# Altium schematic sheet BlockDiagram.SchDoc
size A4; DrawnBy: Santiago Rodriguez; Revision: V1; SheetNumber: 2; SheetTotal: 10
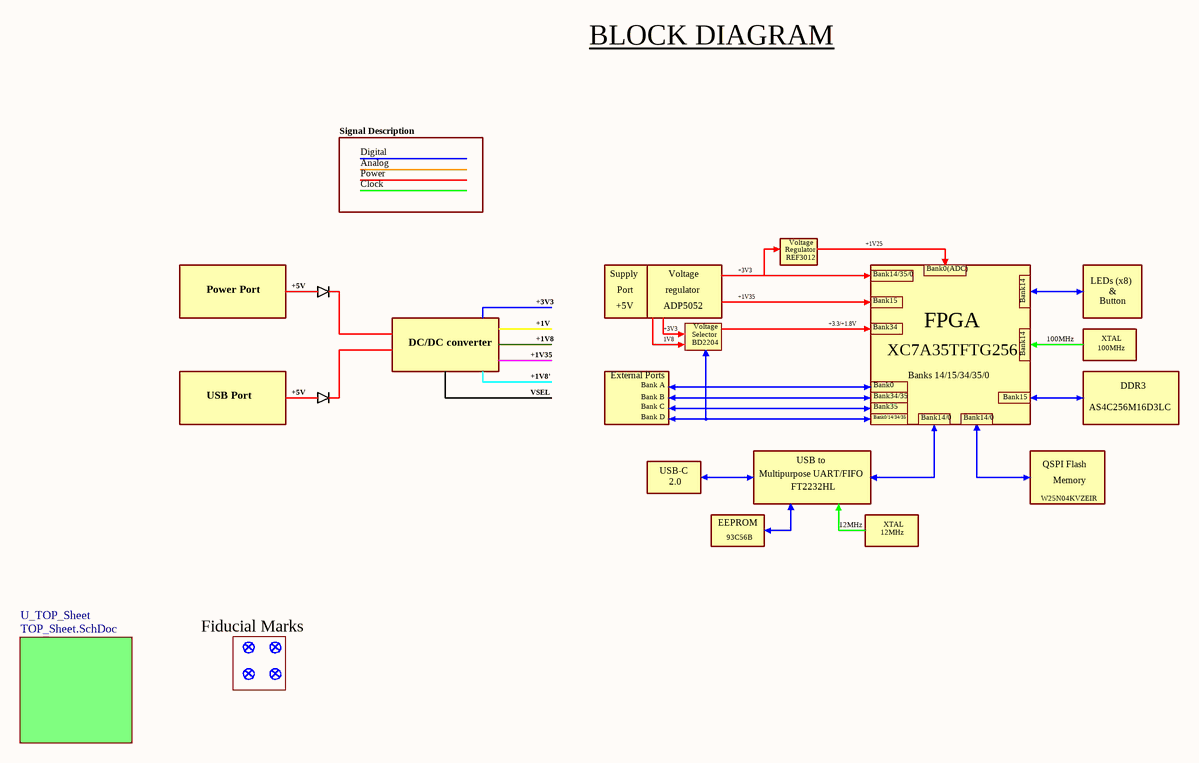
[diagram p0: BlockDiagram.SchDoc]

## Sub-sheets
U_TOP_Sheet = TOP_Sheet.SchDoc: no entries

## Notes on the sheet
- BLOCK DIAGRAM
- Signal Description
- Digital
- Analog
- Power
- Clock
- Power Port
- +5V
- +3V3
- Supply
- Port
- ADP5052
- regulator
- Voltage
- +1V35
- Regulator
- REF3012
- +1V25
- Bank14/35/0
- Bank15
- Bank0(ADC)
- Bank14
- LEDs (x8)
- Button
- &
- DC/DC converter
- +1V8'
- +1V
- +1V8
- External Ports
- 1V8
- Selector
- BD2204
- +3.3/+1.8V
- Bank34
- XC7A35TFTG256
- Banks 14/15/34/35/0
- FPGA
- 100MHz
- XTAL
- USB Port
- VSEL
- Bank A
- Bank B
- Bank C
- Bank D
- Bank0
- Bank34/35
- Bank35
- Bank0/14/34/35
- Bank14/0
- AS4C256M16D3LC
- DDR3
- USB-C
- 2.0
- Multipurpose UART/FIFO
- FT2232HL
- USB to
- W25N04KVZEIR
- QSPI Flash
- Memory
- EEPROM
- 93C56B
- 12MHz
- Fiducial Marks
- Proyect Name:
- Sheet Name:
- Drawn by:
- Revision:
- Sheet Number:
- Of
- Date: